# Altium schematic sheet Digital.SchDoc: {Наименование}
size 420 x 297 mm; DocumentNumber: ПЛАС.ХХХХХХ.ХХХ ХХ; SheetNumber: {}; SheetTotal: {}; PageSetup: Record=PageOptions|CenterHorizontal=False|CenterVertical=False|PrintScale=0.95|XCorrection=0.00|YCorrection=0.00|PrintKind=1|BorderSize=5000000|LeftOffset=0|BottomOffset=0|Orientation=1|PaperLength=1000|PaperWidth=1000|Scale=100|PaperSource=15|PrintQuality=600|MediaType=1|DitherType=10|PaperKind=A4|PrintScaleMode=1; Rule: PcbType=ProtelPcb
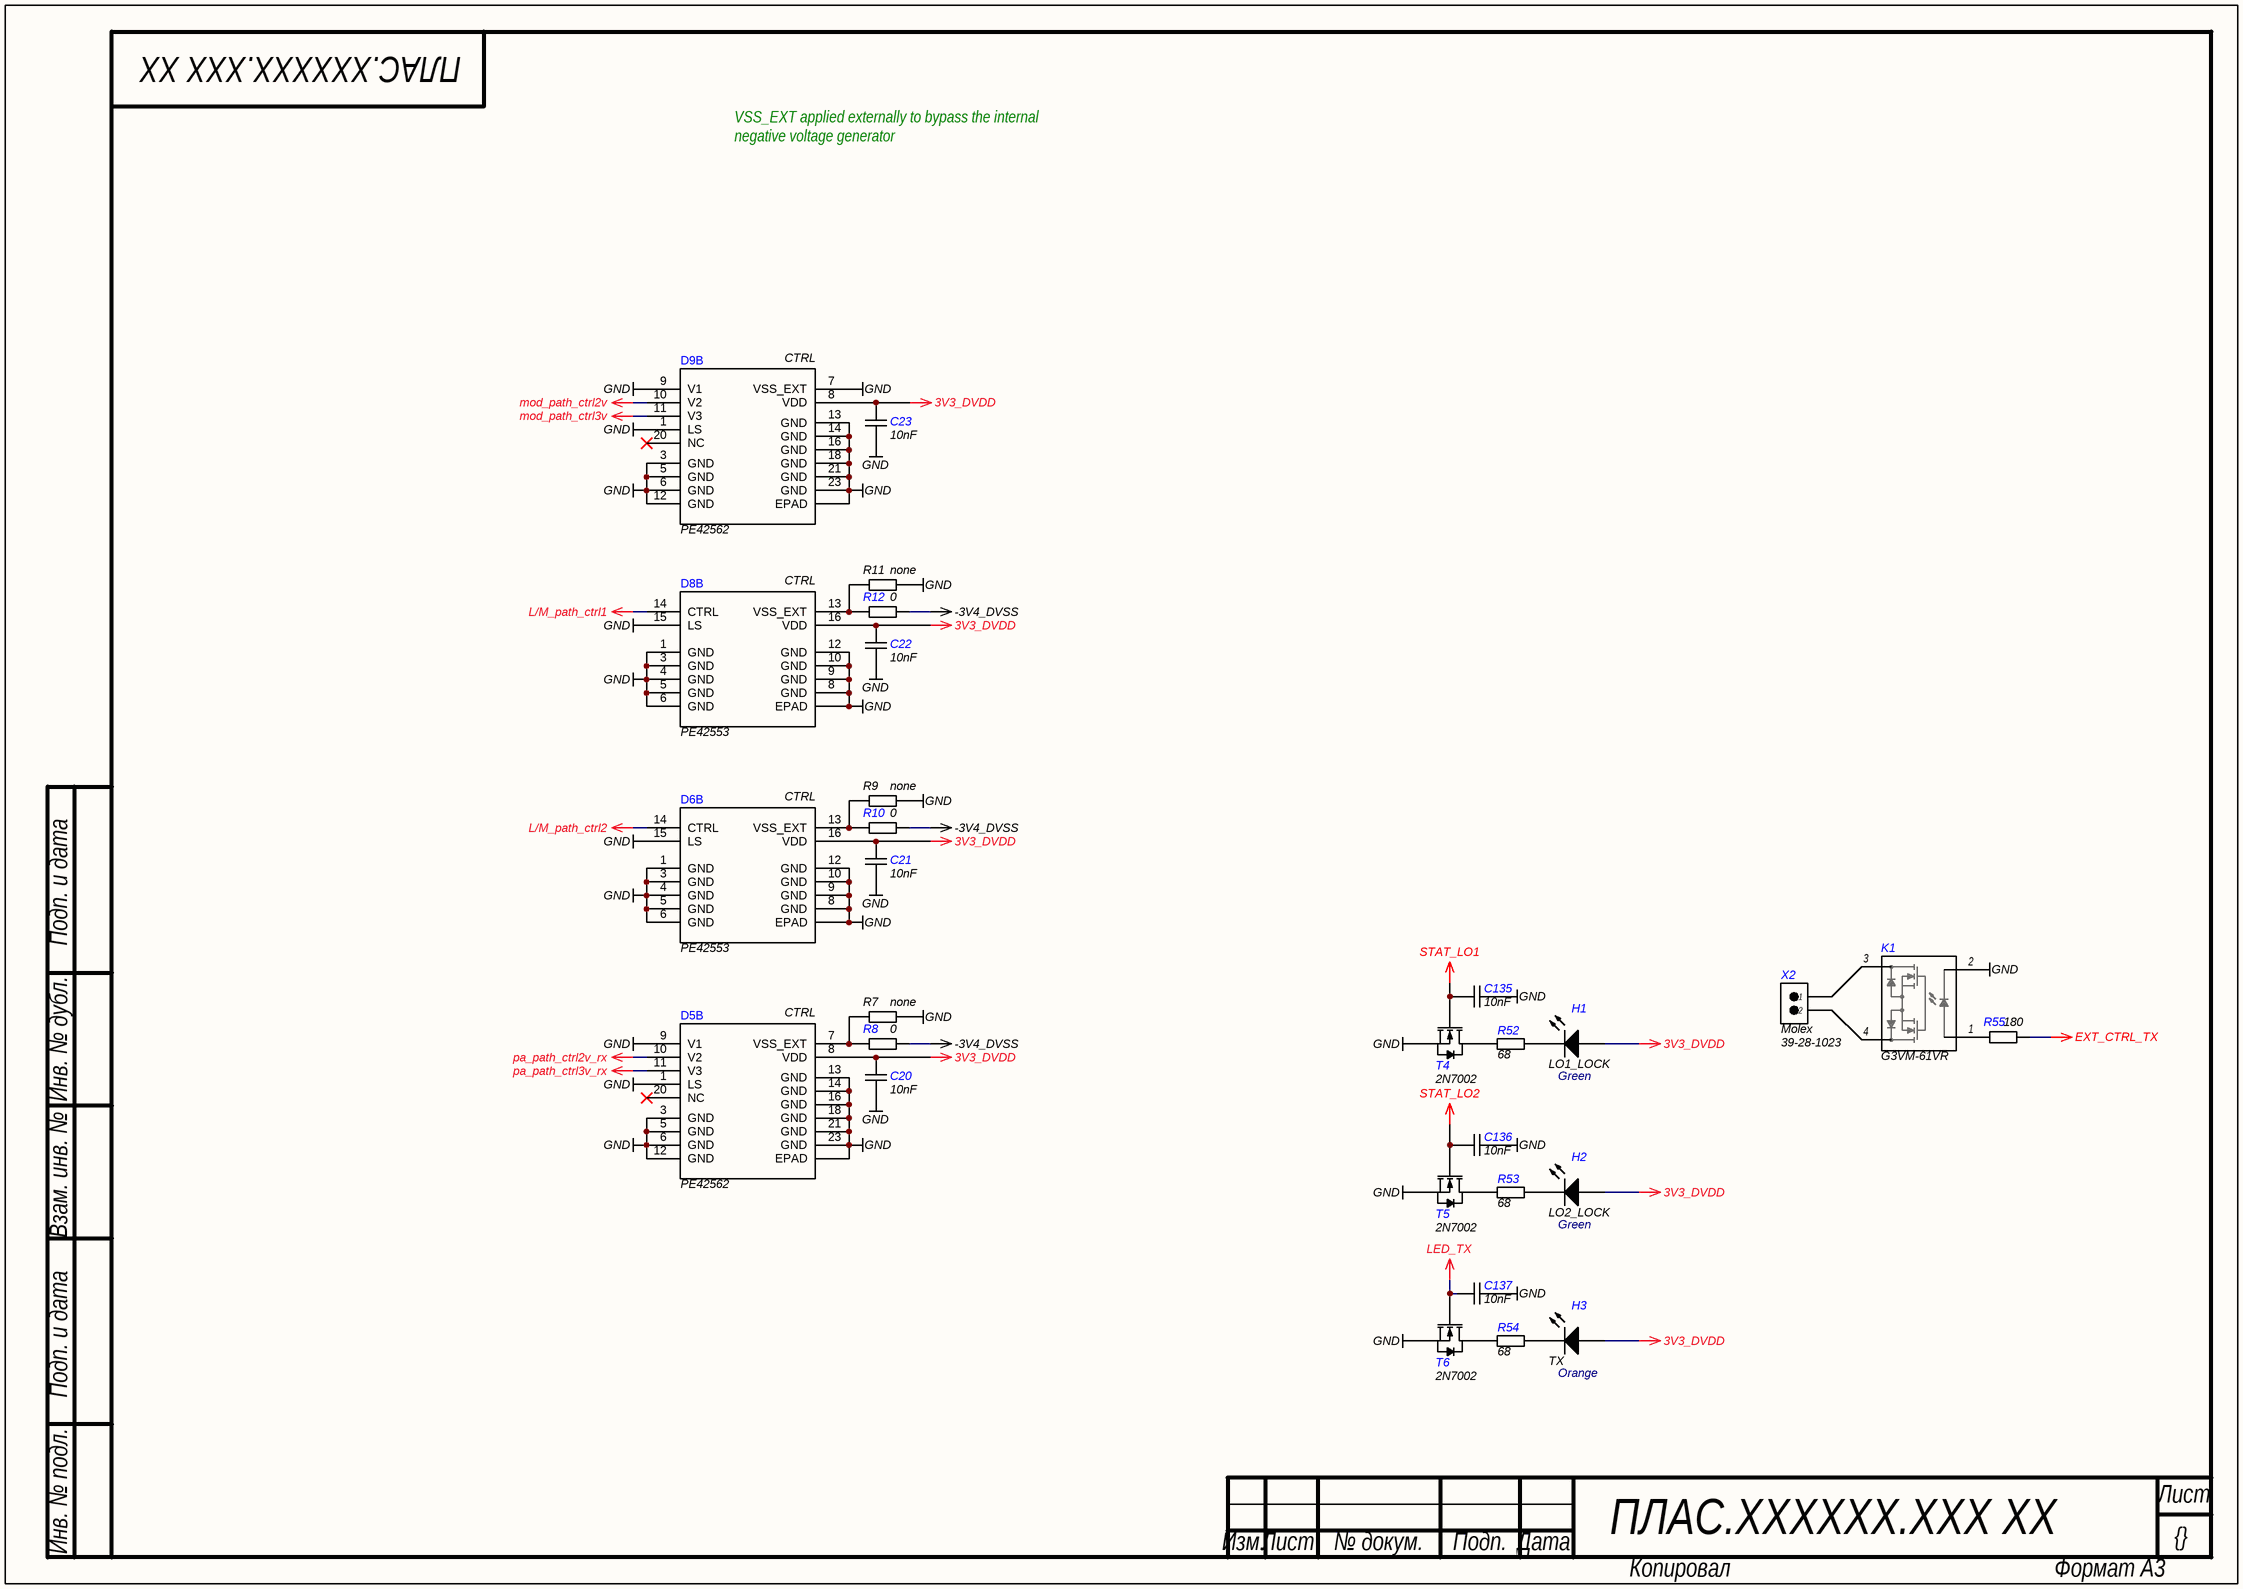
[diagram p0: Digital.SchDoc]

## Parts
C20  value 10nF  [C0402]  (hidden comment: CAP)
C21  value 10nF  [C0402]  (hidden comment: CAP)
C22  value 10nF  [C0402]  (hidden comment: CAP)
C23  value 10nF  [C0402]  (hidden comment: CAP)
C135  value 10nF  [C0402]  (hidden comment: CAP)
C136  value 10nF  [C0402]  (hidden comment: CAP)
C137  value 10nF  [C0402]  (hidden comment: CAP)
D5  PE42562  [QFN-24]  (part B of 2)
D6  PE42553  [QFN-16]  (part B of 2)
D8  PE42553  [QFN-16]  (part B of 2)
D9  PE42562  [QFN-24]  (part B of 2)
H1  LO1_LOCK  Color: Green  [LED_0805_Green]
H2  LO2_LOCK  Color: Green  [LED_0805_Green]
H3  TX  Color: Orange  [LED_0805_Green]
K1  G3VM-61VR  [G3VM-61]
R7  value none  [R0603]  (hidden comment: RES)
R8  value 0  [R0603]  (hidden comment: RES)
R9  value none  [R0603]  (hidden comment: RES)
R10  value 0  [R0603]  (hidden comment: RES)
R11  value none  [R0603]  (hidden comment: RES)
R12  value 0  [R0603]  (hidden comment: RES)
R52  value 68  [R0402]  (hidden comment: RES)
R53  value 68  [R0402]  (hidden comment: RES)
R54  value 68  [R0402]  (hidden comment: RES)
R55  value 180  [R0402]  (hidden comment: RES)
T4  2N7002  [SOT-23]
T5  2N7002  [SOT-23]
T6  2N7002  [SOT-23]
X2  Manufacturer: Molex  P/N: 39-28-1023  [Mini-Fit Jr. Vertical Header]  (hidden comment: Mini-Fit Jr. Vertical Header)

## Nets
3V3_DVDD: C20.1 C21.1 C22.1 C23.1 D5.8(VDD) D6.16(VDD) D8.16(VDD) D9.8(VDD) H1.2(A) H2.2(A) H3.2(A)
-3V4_DVSS: R8.1 R10.1 R12.1
EXT_CTRL_TX: R55.2
GND: C20.2 C21.2 C22.2 C23.2 C135.2 C136.2 C137.2 D5.1(LS) D5.3(GND) D5.5(GND) D5.6(GND) D5.9(V1) D5.12(GND) D5.13(GND) D5.14(GND) D5.16(GND) D5.18(GND) D5.21(GND) D5.23(GND) D5.25(EPAD) D6.1(GND) D6.3(GND) D6.4(GND) D6.5(GND) D6.6(GND) D6.8(GND) D6.9(GND) D6.10(GND) D6.12(GND) D6.15(LS) D6.17(EPAD) D8.1(GND) D8.3(GND) D8.4(GND) D8.5(GND) D8.6(GND) D8.8(GND) D8.9(GND) D8.10(GND) D8.12(GND) D8.15(LS) D8.17(EPAD) D9.1(LS) D9.3(GND) D9.5(GND) D9.6(GND) D9.7(VSS_EXT) D9.9(V1) D9.12(GND) D9.13(GND) D9.14(GND) D9.16(GND) D9.18(GND) D9.21(GND) D9.23(GND) D9.25(EPAD) K1.2 R7.2 R9.2 R11.2 T4.2(S) T5.2(S) T6.2(S)
L/M_path_ctrl1: D8.14(CTRL)
L/M_path_ctrl2: D6.14(CTRL)
LED_TX: C137.1 T6.1(G)
mod_path_ctrl2v: D9.10(V2)
mod_path_ctrl3v: D9.11(V3)
pa_path_ctrl2v_rx: D5.10(V2)
pa_path_ctrl3v_rx: D5.11(V3)
STAT_LO1: C135.1 T4.1(G)
STAT_LO2: C136.1 T5.1(G)
NetD5_7: D5.7(VSS_EXT) R7.1 R8.2
NetD6_13: D6.13(VSS_EXT) R9.1 R10.2
NetD8_13: D8.13(VSS_EXT) R11.1 R12.2
NetH1_1: H1.1(K) R52.2
NetH2_1: H2.1(K) R53.2
NetH3_1: H3.1(K) R54.2
NetK1_1: K1.1 R55.1
NetK1_3: K1.3 X2.1
NetK1_4: K1.4 X2.2
NetR52_1: R52.1 T4.3(D)
NetR53_1: R53.1 T5.3(D)
NetR54_1: R54.1 T6.3(D)

Not connected (* = marked no-connect by the designer): D5 20(NC)*; D9 20(NC)*

## Notes on the sheet
- VSS_EXT applied externally to bypass the internal
  negative voltage generator
- Подп. и дата
- Инв. № дубл.
- Взам. инв. №
- Инв. № подл.
- Лист
- Изм.
- № докум.
- Подп.
- Дата
- Копировал
- Формат А3
- (in symbol PE42562, part B) CTRL

## Library data of the parts
C20-C23 C135-C137 = CAP: SMD Capacitor; Manufacturer: Murata; Material: X7R; Tolerance: 10%; Voltage: 25V; Type: Ceramic Capacitor; P/N: GRM155R71E103KA01D; Supplier 1: Digi-key; Supplier Part Number 1: 490-1312-1-ND; Supplier 2: Mouser; Supplier Part Number 2: 81-GRM36X103K25; Supplier 3: Farnell; Supplier Part Number 3: *
D5 D9 = PE42562: The PE42582 is a HaRP™ technology-enhanced absorptive SP6T RF switch; Manufacturer: Peregrine Technical Solutions; P/N: PE42562A-X; Name: PE42562; Package: 24-lead 4 × 4 × 0.85 mm QFN; Type: Absorptive SP6T RF switch; Supplier 1: Digi-key; Supplier Part Number 1: *; Supplier 2: Mouser; Supplier Part Number 2: 81-PE42562A-X; Supplier 3: Farnell; Supplier Part Number 3: *
D6 D8 = PE42553: HaRPTM technology-enhanced absorptive SPDT; Manufacturer: Peregrine Technical Solutions; P/N: PE42553A-Z; Type: SPDT RF Switch; Name: PE42553; Package: 16-lead 3 × 3 mm QFN; Supplier 1: Digi-Key; Supplier Part Number 1: 1046-1137-1-ND; Supplier 2: Mouser; Supplier Part Number 2: 81-PE42553B-Z; Supplier 3: Farnell; Supplier Part Number 3: *
H1 H2 = LED: CHIP LED LAMP; Manufacturer: Kingbright; Name: APHCM2012; P/N: APHCM2012CGCK-F01; Package: 2.0 x 1.25 mm SMD; Type: CHIP LED LAMP; Supplier 1: Digi-Key; Supplier Part Number 1: 754-1094-1-ND; Supplier 2: Mouser; Supplier Part Number 2: 604-APHCM2012CGCK; Supplier 3: Farnell; Supplier Part Number 3: *
H3 = LED: CHIP LED LAMP; Manufacturer: Kingbright; Name: APHCM2012; P/N: APHCM2012SECK-F01; Package: 2.0 x 1.25 mm SMD; Type: CHIP LED LAMP; Supplier 1: Digi-key; Supplier Part Number 1: 754-1096-1-ND; Supplier 2: Mouser; Supplier Part Number 2: 604-APHCM2012SECK; Supplier 3: Farnell; Supplier Part Number 3: *
K1 = G3VM-61GR1: MOS FET Relay; Manufacturer: Omron; Channel Resistance: 250 mOhm; Current: 1.4A; Voltage: 60V; Name: G3VM-61VR; Package: SOT-23F; P/N: G3VM-61VR; Supplier 1: Digi-Key; Supplier Part Number 1: Z10319CT-ND; Supplier 2: Mouser; Supplier Part Number 2: 653-G3VM-61VRTR05; Supplier 3: Farnell; Supplier Part Number 3: *
R7-R12 = RES: SMD Resistor; Name: Chip SMD Resistor; Power: 0.1 Wt; Tolerance: 1%; P/N: ERJ-3GEY0R00V; Temperature Range: -55…155°C; Supplier 1: Digi-key; Supplier Part Number 1: P0.0GCT-ND; Supplier 2: Mouser; Supplier Part Number 2: 667-ERJ-3GEY0R00V; Supplier 3: Farnell; Supplier Part Number 3: *
R52-R54 = RES: SMD Resistor; Name: Chip SMD Resistor; Power: 0.062 Wt; Tolerance: 5%; P/N: ERJ-2GEJ680X; Temperature Range: -55…155°C; Supplier 1: Digi-key; Supplier Part Number 1: P68JCT-ND; Supplier 2: Mouser; Supplier Part Number 2: 667-ERJ-2GEJ680X; Supplier 3: Farnell; Supplier Part Number 3: *
R55 = RES: SMD Resistor; Manufacturer: Panasonic Electronic Components; Name: Chip SMD Resistor; Power: 0.063 Wt; Tolerance: 1%; P/N: ERJ-2RKF1800X; Temperature Range: -55…155°C; Supplier 1: Digi-key; Supplier Part Number 1: P180LCT-ND; Supplier 2: Mouser; Supplier Part Number 2: 667-ERJ-2RKF1800X; Supplier 3: Farnell; Supplier Part Number 3: *
T4-T6 = 2N7002: N-Channel MOSFET 2N7002; Channel Resistance: 5Ohm; Current: 300mA; Power Dissipation: 0.83W; Voltage: 60V; Name: 2N7002; Type: SOT-23; Package: SOT-23; Supplier 1: Digi-key; Supplier Part Number 1: 1727-8645-1-ND; Supplier 2: Mouser; Supplier Part Number 2: 771-2N7002/HAMR; Supplier 3: Farnell; Supplier Part Number 3: *
X2 = Mini-Fit Jr. Vertical Header: 4.20mm Pitch, Dual Row, 2 Circuits, without Snap-in Plastic Peg PCB Lock; Mate With Series: 5557; Name: Mini-Fit Jr. Vertical Header; Series: 5566; Type: Mini-Fit Jr. Vertical Header, 4.20mm Pitch, Dual Row, 2 Circuits, without Snap-in Plastic Peg PCB Lock; Mate With P/N: 39-01-2020; Supplier 1: Digi-key; Supplier Part Number 1: WM3800-ND; Supplier 2: Mouser; Supplier Part Number 2: 538-39-28-1023; Supplier 3: Farnell; Supplier Part Number 3: *